# Altium schematic sheet LED fix910 RD 2000278 (4F00223A_7P00493A)_2.SchDoc
size 599 x 241 mm
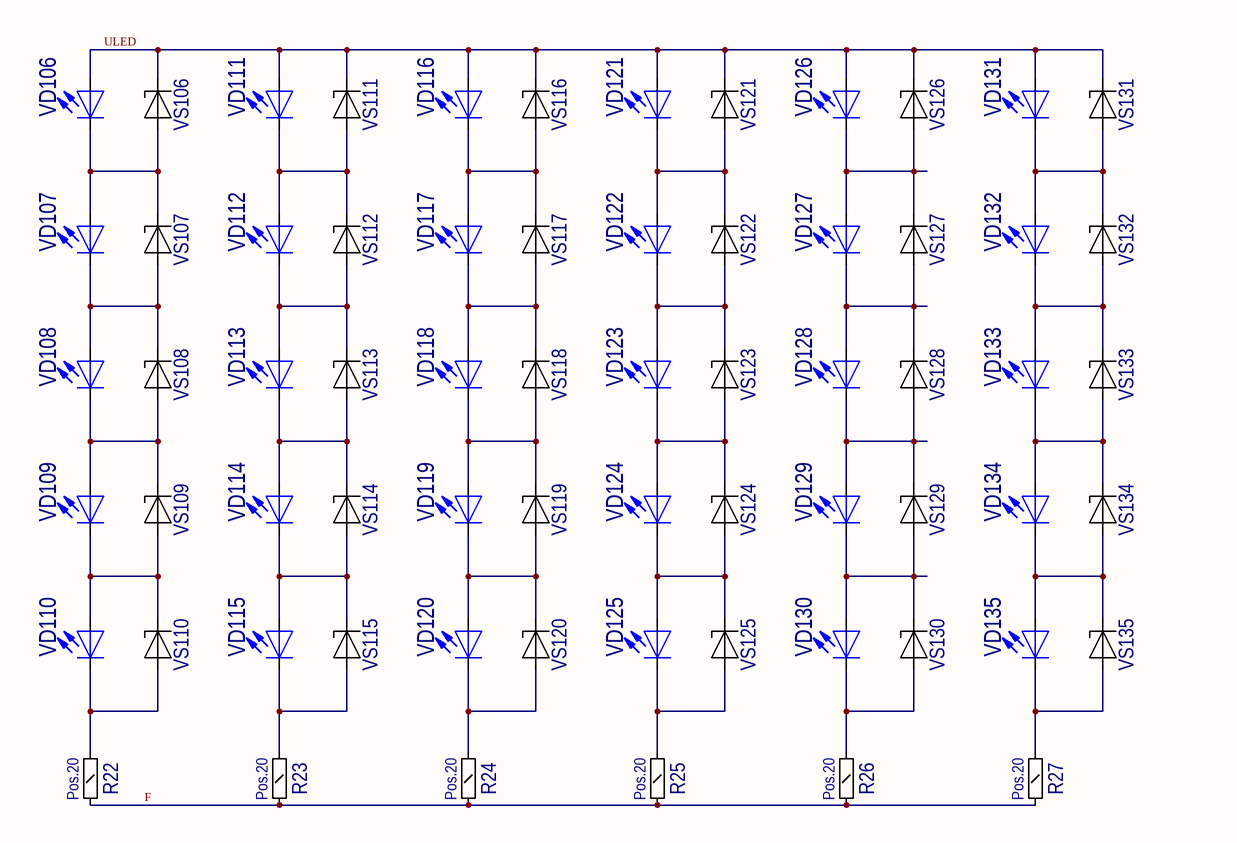
[diagram p0: LED fix910 RD 2000278 (4F00223A_7P00493A)_2.SchDoc, left]
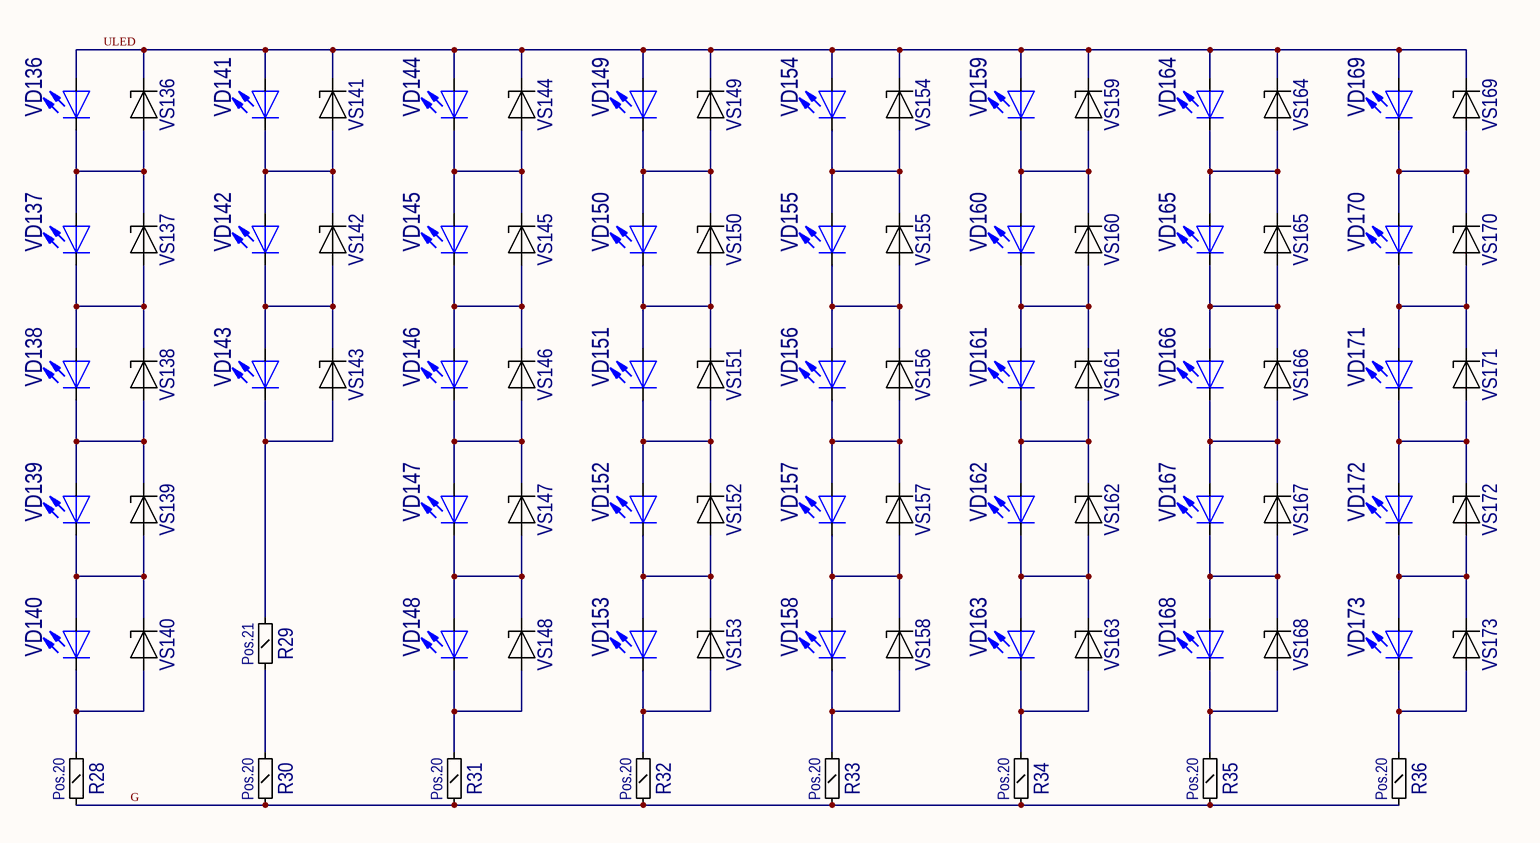
[diagram p1: LED fix910 RD 2000278 (4F00223A_7P00493A)_2.SchDoc, right]

## Parts
R22  value Pos.20  [RC1206S]  (hidden comment: R1206S)
R23  value Pos.20  [RC1206S]  (hidden comment: R1206S)
R24  value Pos.20  [RC1206S]  (hidden comment: R1206S)
R25  value Pos.20  [RC1206S]  (hidden comment: R1206S)
R26  value Pos.20  [RC1206S]  (hidden comment: R1206S)
R27  value Pos.20  [RC1206S]  (hidden comment: R1206S)
R28  value Pos.20  [RC1206S]  (hidden comment: R1206S)
R29  value Pos.21  [RC1206S]  (hidden comment: R1206S)
R30  value Pos.20  [RC1206S]  (hidden comment: R1206S)
R31  value Pos.20  [RC1206S]  (hidden comment: R1206S)
R32  value Pos.20  [RC1206S]  (hidden comment: R1206S)
R33  value Pos.20  [RC1206S]  (hidden comment: R1206S)
R34  value Pos.20  [RC1206S]  (hidden comment: R1206S)
R35  value Pos.20  [RC1206S]  (hidden comment: R1206S)
R36  value Pos.20  [RC1206S]  (hidden comment: R1206S)
VD106  LED, LS E65F-BBDA-1-Z, Red, OSRAM Opto Semiconductors Inc.  [E65F]  (value not drawn)
VD107  LED, LS E65F-BBDA-1-Z, Red, OSRAM Opto Semiconductors Inc.  [E65F]  (value not drawn)
VD108  LED, LS E65F-BBDA-1-Z, Red, OSRAM Opto Semiconductors Inc.  [E65F]  (value not drawn)
VD109  LED, LS E65F-BBDA-1-Z, Red, OSRAM Opto Semiconductors Inc.  [E65F]  (value not drawn)
VD110  LED, LS E65F-BBDA-1-Z, Red, OSRAM Opto Semiconductors Inc.  [E65F]  (value not drawn)
VD111  LED, LS E65F-BBDA-1-Z, Red, OSRAM Opto Semiconductors Inc.  [E65F]  (value not drawn)
VD112  LED, LS E65F-BBDA-1-Z, Red, OSRAM Opto Semiconductors Inc.  [E65F]  (value not drawn)
VD113  LED, LS E65F-BBDA-1-Z, Red, OSRAM Opto Semiconductors Inc.  [E65F]  (value not drawn)
VD114  LED, LS E65F-BBDA-1-Z, Red, OSRAM Opto Semiconductors Inc.  [E65F]  (value not drawn)
VD115  LED, LS E65F-BBDA-1-Z, Red, OSRAM Opto Semiconductors Inc.  [E65F]  (value not drawn)
VD116  LED, LS E65F-BBDA-1-Z, Red, OSRAM Opto Semiconductors Inc.  [E65F]  (value not drawn)
VD117  LED, LS E65F-BBDA-1-Z, Red, OSRAM Opto Semiconductors Inc.  [E65F]  (value not drawn)
VD118  LED, LS E65F-BBDA-1-Z, Red, OSRAM Opto Semiconductors Inc.  [E65F]  (value not drawn)
VD119  LED, LS E65F-BBDA-1-Z, Red, OSRAM Opto Semiconductors Inc.  [E65F]  (value not drawn)
VD120  LED, LS E65F-BBDA-1-Z, Red, OSRAM Opto Semiconductors Inc.  [E65F]  (value not drawn)
VD121  LED, LS E65F-BBDA-1-Z, Red, OSRAM Opto Semiconductors Inc.  [E65F]  (value not drawn)
VD122  LED, LS E65F-BBDA-1-Z, Red, OSRAM Opto Semiconductors Inc.  [E65F]  (value not drawn)
VD123  LED, LS E65F-BBDA-1-Z, Red, OSRAM Opto Semiconductors Inc.  [E65F]  (value not drawn)
VD124  LED, LS E65F-BBDA-1-Z, Red, OSRAM Opto Semiconductors Inc.  [E65F]  (value not drawn)
VD125  LED, LS E65F-BBDA-1-Z, Red, OSRAM Opto Semiconductors Inc.  [E65F]  (value not drawn)
VD126  LED, LS E65F-BBDA-1-Z, Red, OSRAM Opto Semiconductors Inc.  [E65F]  (value not drawn)
VD127  LED, LS E65F-BBDA-1-Z, Red, OSRAM Opto Semiconductors Inc.  [E65F]  (value not drawn)
VD128  LED, LS E65F-BBDA-1-Z, Red, OSRAM Opto Semiconductors Inc.  [E65F]  (value not drawn)
VD129  LED, LS E65F-BBDA-1-Z, Red, OSRAM Opto Semiconductors Inc.  [E65F]  (value not drawn)
VD130  LED, LS E65F-BBDA-1-Z, Red, OSRAM Opto Semiconductors Inc.  [E65F]  (value not drawn)
VD131  LED, LS E65F-BBDA-1-Z, Red, OSRAM Opto Semiconductors Inc.  [E65F]  (value not drawn)
VD132  LED, LS E65F-BBDA-1-Z, Red, OSRAM Opto Semiconductors Inc.  [E65F]  (value not drawn)
VD133  LED, LS E65F-BBDA-1-Z, Red, OSRAM Opto Semiconductors Inc.  [E65F]  (value not drawn)
VD134  LED, LS E65F-BBDA-1-Z, Red, OSRAM Opto Semiconductors Inc.  [E65F]  (value not drawn)
VD135  LED, LS E65F-BBDA-1-Z, Red, OSRAM Opto Semiconductors Inc.  [E65F]  (value not drawn)
VD136  LED, LS E65F-BBDA-1-Z, Red, OSRAM Opto Semiconductors Inc.  [E65F]  (value not drawn)
VD137  LED, LS E65F-BBDA-1-Z, Red, OSRAM Opto Semiconductors Inc.  [E65F]  (value not drawn)
VD138  LED, LS E65F-BBDA-1-Z, Red, OSRAM Opto Semiconductors Inc.  [E65F]  (value not drawn)
VD139  LED, LS E65F-BBDA-1-Z, Red, OSRAM Opto Semiconductors Inc.  [E65F]  (value not drawn)
VD140  LED, LS E65F-BBDA-1-Z, Red, OSRAM Opto Semiconductors Inc.  [E65F]  (value not drawn)
VD141  LED, LS E65F-BBDA-1-Z, Red, OSRAM Opto Semiconductors Inc.  [E65F]  (value not drawn)
VD142  LED, LS E65F-BBDA-1-Z, Red, OSRAM Opto Semiconductors Inc.  [E65F]  (value not drawn)
VD143  LED, LS E65F-BBDA-1-Z, Red, OSRAM Opto Semiconductors Inc.  [E65F]  (value not drawn)
VD144  LED, LS E65F-BBDA-1-Z, Red, OSRAM Opto Semiconductors Inc.  [E65F]  (value not drawn)
VD145  LED, LS E65F-BBDA-1-Z, Red, OSRAM Opto Semiconductors Inc.  [E65F]  (value not drawn)
VD146  LED, LS E65F-BBDA-1-Z, Red, OSRAM Opto Semiconductors Inc.  [E65F]  (value not drawn)
VD147  LED, LS E65F-BBDA-1-Z, Red, OSRAM Opto Semiconductors Inc.  [E65F]  (value not drawn)
VD148  LED, LS E65F-BBDA-1-Z, Red, OSRAM Opto Semiconductors Inc.  [E65F]  (value not drawn)
VD149  LED, LS E65F-BBDA-1-Z, Red, OSRAM Opto Semiconductors Inc.  [E65F]  (value not drawn)
VD150  LED, LS E65F-BBDA-1-Z, Red, OSRAM Opto Semiconductors Inc.  [E65F]  (value not drawn)
VD151  LED, LS E65F-BBDA-1-Z, Red, OSRAM Opto Semiconductors Inc.  [E65F]  (value not drawn)
VD152  LED, LS E65F-BBDA-1-Z, Red, OSRAM Opto Semiconductors Inc.  [E65F]  (value not drawn)
VD153  LED, LS E65F-BBDA-1-Z, Red, OSRAM Opto Semiconductors Inc.  [E65F]  (value not drawn)
VD154  LED, LS E65F-BBDA-1-Z, Red, OSRAM Opto Semiconductors Inc.  [E65F]  (value not drawn)
VD155  LED, LS E65F-BBDA-1-Z, Red, OSRAM Opto Semiconductors Inc.  [E65F]  (value not drawn)
VD156  LED, LS E65F-BBDA-1-Z, Red, OSRAM Opto Semiconductors Inc.  [E65F]  (value not drawn)
VD157  LED, LS E65F-BBDA-1-Z, Red, OSRAM Opto Semiconductors Inc.  [E65F]  (value not drawn)
VD158  LED, LS E65F-BBDA-1-Z, Red, OSRAM Opto Semiconductors Inc.  [E65F]  (value not drawn)
VD159  LED, LS E65F-BBDA-1-Z, Red, OSRAM Opto Semiconductors Inc.  [E65F]  (value not drawn)
VD160  LED, LS E65F-BBDA-1-Z, Red, OSRAM Opto Semiconductors Inc.  [E65F]  (value not drawn)
VD161  LED, LS E65F-BBDA-1-Z, Red, OSRAM Opto Semiconductors Inc.  [E65F]  (value not drawn)
VD162  LED, LS E65F-BBDA-1-Z, Red, OSRAM Opto Semiconductors Inc.  [E65F]  (value not drawn)
VD163  LED, LS E65F-BBDA-1-Z, Red, OSRAM Opto Semiconductors Inc.  [E65F]  (value not drawn)
VD164  LED, LS E65F-BBDA-1-Z, Red, OSRAM Opto Semiconductors Inc.  [E65F]  (value not drawn)
VD165  LED, LS E65F-BBDA-1-Z, Red, OSRAM Opto Semiconductors Inc.  [E65F]  (value not drawn)
VD166  LED, LS E65F-BBDA-1-Z, Red, OSRAM Opto Semiconductors Inc.  [E65F]  (value not drawn)
VD167  LED, LS E65F-BBDA-1-Z, Red, OSRAM Opto Semiconductors Inc.  [E65F]  (value not drawn)
VD168  LED, LS E65F-BBDA-1-Z, Red, OSRAM Opto Semiconductors Inc.  [E65F]  (value not drawn)
VD169  LED, LS E65F-BBDA-1-Z, Red, OSRAM Opto Semiconductors Inc.  [E65F]  (value not drawn)
VD170  LED, LS E65F-BBDA-1-Z, Red, OSRAM Opto Semiconductors Inc.  [E65F]  (value not drawn)
VD171  LED, LS E65F-BBDA-1-Z, Red, OSRAM Opto Semiconductors Inc.  [E65F]  (value not drawn)
VD172  LED, LS E65F-BBDA-1-Z, Red, OSRAM Opto Semiconductors Inc.  [E65F]  (value not drawn)
VD173  LED, LS E65F-BBDA-1-Z, Red, OSRAM Opto Semiconductors Inc.  [E65F]  (value not drawn)
VS106  BZX84  [SOT23]  (value not drawn)
VS107  BZX84  [SOT23]  (value not drawn)
VS108  BZX84  [SOT23]  (value not drawn)
VS109  BZX84  [SOT23]  (value not drawn)
VS110  BZX84  [SOT23]  (value not drawn)
VS111  BZX84  [SOT23]  (value not drawn)
VS112  BZX84  [SOT23]  (value not drawn)
VS113  BZX84  [SOT23]  (value not drawn)
VS114  BZX84  [SOT23]  (value not drawn)
VS115  BZX84  [SOT23]  (value not drawn)
VS116  BZX84  [SOT23]  (value not drawn)
VS117  BZX84  [SOT23]  (value not drawn)
VS118  BZX84  [SOT23]  (value not drawn)
VS119  BZX84  [SOT23]  (value not drawn)
VS120  BZX84  [SOT23]  (value not drawn)
VS121  BZX84  [SOT23]  (value not drawn)
VS122  BZX84  [SOT23]  (value not drawn)
VS123  BZX84  [SOT23]  (value not drawn)
VS124  BZX84  [SOT23]  (value not drawn)
VS125  BZX84  [SOT23]  (value not drawn)
VS126  BZX84  [SOT23]  (value not drawn)
VS127  BZX84  [SOT23]  (value not drawn)
VS128  BZX84  [SOT23]  (value not drawn)
VS129  BZX84  [SOT23]  (value not drawn)
VS130  BZX84  [SOT23]  (value not drawn)
VS131  BZX84  [SOT23]  (value not drawn)
VS132  BZX84  [SOT23]  (value not drawn)
VS133  BZX84  [SOT23]  (value not drawn)
VS134  BZX84  [SOT23]  (value not drawn)
VS135  BZX84  [SOT23]  (value not drawn)
VS136  BZX84  [SOT23]  (value not drawn)
VS137  BZX84  [SOT23]  (value not drawn)
VS138  BZX84  [SOT23]  (value not drawn)
VS139  BZX84  [SOT23]  (value not drawn)
VS140  BZX84  [SOT23]  (value not drawn)
VS141  BZX84  [SOT23]  (value not drawn)
VS142  BZX84  [SOT23]  (value not drawn)
VS143  BZX84  [SOT23]  (value not drawn)
VS144  BZX84  [SOT23]  (value not drawn)
VS145  BZX84  [SOT23]  (value not drawn)
VS146  BZX84  [SOT23]  (value not drawn)
VS147  BZX84  [SOT23]  (value not drawn)
VS148  BZX84  [SOT23]  (value not drawn)
VS149  BZX84  [SOT23]  (value not drawn)
VS150  BZX84  [SOT23]  (value not drawn)
VS151  BZX84  [SOT23]  (value not drawn)
VS152  BZX84  [SOT23]  (value not drawn)
VS153  BZX84  [SOT23]  (value not drawn)
VS154  BZX84  [SOT23]  (value not drawn)
VS155  BZX84  [SOT23]  (value not drawn)
VS156  BZX84  [SOT23]  (value not drawn)
VS157  BZX84  [SOT23]  (value not drawn)
VS158  BZX84  [SOT23]  (value not drawn)
VS159  BZX84  [SOT23]  (value not drawn)
VS160  BZX84  [SOT23]  (value not drawn)
VS161  BZX84  [SOT23]  (value not drawn)
VS162  BZX84  [SOT23]  (value not drawn)
VS163  BZX84  [SOT23]  (value not drawn)
VS164  BZX84  [SOT23]  (value not drawn)
VS165  BZX84  [SOT23]  (value not drawn)
VS166  BZX84  [SOT23]  (value not drawn)
VS167  BZX84  [SOT23]  (value not drawn)
VS168  BZX84  [SOT23]  (value not drawn)
VS169  BZX84  [SOT23]  (value not drawn)
VS170  BZX84  [SOT23]  (value not drawn)
VS171  BZX84  [SOT23]  (value not drawn)
VS172  BZX84  [SOT23]  (value not drawn)
VS173  BZX84  [SOT23]  (value not drawn)

## Nets
F: R22.2 R23.2 R24.2 R25.2 R26.2 R27.2
G: R28.2 R30.2 R31.2 R32.2 R33.2 R34.2 R35.2 R36.2
ULED: VD106.2(A) VD111.2(A) VD116.2(A) VD121.2(A) VD126.2(A) VD131.2(A) VD136.2(A) VD141.2(A) VD144.2(A) VD149.2(A) VD154.2(A) VD159.2(A) VD164.2(A) VD169.2(A) VS106.3 VS111.3 VS116.3 VS121.3 VS126.3 VS131.3 VS136.3 VS141.3 VS144.3 VS149.3 VS154.3 VS159.3 VS164.3 VS169.3
NetR22_1: R22.1 VD110.1(K) VS110.1
NetR23_1: R23.1 VD115.1(K) VS115.1
NetR24_1: R24.1 VD120.1(K) VS120.1
NetR25_1: R25.1 VD125.1(K) VS125.1
NetR26_1: R26.1 VD130.1(K) VS130.1
NetR27_1: R27.1 VD135.1(K) VS135.1
NetR28_1: R28.1 VD140.1(K) VS140.1
NetR29_1: R29.1 VD143.1(K) VS143.1
NetR29_2: R29.2 R30.1
NetR31_1: R31.1 VD148.1(K) VS148.1
NetR32_1: R32.1 VD153.1(K) VS153.1
NetR33_1: R33.1 VD158.1(K) VS158.1
NetR34_1: R34.1 VD163.1(K) VS163.1
NetR35_1: R35.1 VD168.1(K) VS168.1
NetR36_1: R36.1 VD173.1(K) VS173.1
NetVD106_1: VD106.1(K) VD107.2(A) VS106.1 VS107.3
NetVD107_1: VD107.1(K) VD108.2(A) VS107.1 VS108.3
NetVD108_1: VD108.1(K) VD109.2(A) VS108.1 VS109.3
NetVD109_1: VD109.1(K) VD110.2(A) VS109.1 VS110.3
NetVD111_1: VD111.1(K) VD112.2(A) VS111.1 VS112.3
NetVD112_1: VD112.1(K) VD113.2(A) VS112.1 VS113.3
NetVD113_1: VD113.1(K) VD114.2(A) VS113.1 VS114.3
NetVD114_1: VD114.1(K) VD115.2(A) VS114.1 VS115.3
NetVD116_1: VD116.1(K) VD117.2(A) VS116.1 VS117.3
NetVD117_1: VD117.1(K) VD118.2(A) VS117.1 VS118.3
NetVD118_1: VD118.1(K) VD119.2(A) VS118.1 VS119.3
NetVD119_1: VD119.1(K) VD120.2(A) VS119.1 VS120.3
NetVD121_1: VD121.1(K) VD122.2(A) VS121.1 VS122.3
NetVD122_1: VD122.1(K) VD123.2(A) VS122.1 VS123.3
NetVD123_1: VD123.1(K) VD124.2(A) VS123.1 VS124.3
NetVD124_1: VD124.1(K) VD125.2(A) VS124.1 VS125.3
NetVD126_1: VD126.1(K) VD127.2(A) VS126.1 VS127.3
NetVD127_1: VD127.1(K) VD128.2(A) VS127.1 VS128.3
NetVD128_1: VD128.1(K) VD129.2(A) VS128.1 VS129.3
NetVD129_1: VD129.1(K) VD130.2(A) VS129.1 VS130.3
NetVD131_1: VD131.1(K) VD132.2(A) VS131.1 VS132.3
NetVD132_1: VD132.1(K) VD133.2(A) VS132.1 VS133.3
NetVD133_1: VD133.1(K) VD134.2(A) VS133.1 VS134.3
NetVD134_1: VD134.1(K) VD135.2(A) VS134.1 VS135.3
NetVD136_1: VD136.1(K) VD137.2(A) VS136.1 VS137.3
NetVD137_1: VD137.1(K) VD138.2(A) VS137.1 VS138.3
NetVD138_1: VD138.1(K) VD139.2(A) VS138.1 VS139.3
NetVD139_1: VD139.1(K) VD140.2(A) VS139.1 VS140.3
NetVD141_1: VD141.1(K) VD142.2(A) VS141.1 VS142.3
NetVD142_1: VD142.1(K) VD143.2(A) VS142.1 VS143.3
NetVD144_1: VD144.1(K) VD145.2(A) VS144.1 VS145.3
NetVD145_1: VD145.1(K) VD146.2(A) VS145.1 VS146.3
NetVD146_1: VD146.1(K) VD147.2(A) VS146.1 VS147.3
NetVD147_1: VD147.1(K) VD148.2(A) VS147.1 VS148.3
NetVD149_1: VD149.1(K) VD150.2(A) VS149.1 VS150.3
NetVD150_1: VD150.1(K) VD151.2(A) VS150.1 VS151.3
NetVD151_1: VD151.1(K) VD152.2(A) VS151.1 VS152.3
NetVD152_1: VD152.1(K) VD153.2(A) VS152.1 VS153.3
NetVD154_1: VD154.1(K) VD155.2(A) VS154.1 VS155.3
NetVD155_1: VD155.1(K) VD156.2(A) VS155.1 VS156.3
NetVD156_1: VD156.1(K) VD157.2(A) VS156.1 VS157.3
NetVD157_1: VD157.1(K) VD158.2(A) VS157.1 VS158.3
NetVD159_1: VD159.1(K) VD160.2(A) VS159.1 VS160.3
NetVD160_1: VD160.1(K) VD161.2(A) VS160.1 VS161.3
NetVD161_1: VD161.1(K) VD162.2(A) VS161.1 VS162.3
NetVD162_1: VD162.1(K) VD163.2(A) VS162.1 VS163.3
NetVD164_1: VD164.1(K) VD165.2(A) VS164.1 VS165.3
NetVD165_1: VD165.1(K) VD166.2(A) VS165.1 VS166.3
NetVD166_1: VD166.1(K) VD167.2(A) VS166.1 VS167.3
NetVD167_1: VD167.1(K) VD168.2(A) VS167.1 VS168.3
NetVD169_1: VD169.1(K) VD170.2(A) VS169.1 VS170.3
NetVD170_1: VD170.1(K) VD171.2(A) VS170.1 VS171.3
NetVD171_1: VD171.1(K) VD172.2(A) VS171.1 VS172.3
NetVD172_1: VD172.1(K) VD173.2(A) VS172.1 VS173.3

Not connected (* = marked no-connect by the designer): VS106 2; VS107 2; VS108 2; VS109 2; VS110 2; VS111 2; VS112 2; VS113 2; VS114 2; VS115 2; VS116 2; VS117 2; VS118 2; VS119 2; VS120 2; VS121 2; VS122 2; VS123 2; VS124 2; VS125 2; VS126 2; VS127 2; VS128 2; VS129 2; VS130 2; VS131 2; VS132 2; VS133 2; VS134 2; VS135 2; VS136 2; VS137 2; VS138 2; VS139 2; VS140 2; VS141 2; VS142 2; VS143 2; VS144 2; VS145 2; VS146 2; VS147 2; VS148 2; VS149 2; VS150 2; VS151 2; VS152 2; VS153 2; VS154 2; VS155 2; VS156 2; VS157 2; VS158 2; VS159 2; VS160 2; VS161 2; VS162 2; VS163 2; VS164 2; VS165 2; VS166 2; VS167 2; VS168 2; VS169 2; VS170 2; VS171 2; VS172 2; VS173 2

## Library data of the parts
VD106-VD173 = 4176: idComponent: 4176; Jofre_PN: HL1032; Component_Group: Diodes; Tech_Specification: LED Chip, LS E65F-BBDA-1-Z, Red, 633nm, 3920mcd, 60 deg, 2,15V, 50 mA, -40°C...+85°C, PLCC-4, OSRAM Opto Semiconductors Inc.; Mounting_Type: SMD; Operating_Temperature: -40°C...+85°C; Notes: price Digi-Key @2.000; User: ke-sta@kd-sta; Value: LS E65F-BBDA-1-Z; Component_Type: LED; Package: PLCC-4; Marking_Code: -; Manufacturer: OSRAM Opto Semiconductors Inc.; Manufacturer_PN: LS E65F-BBDA-1-Z; ComponentLink1Description: Datasheet; ComponentLink1URL: https://media.digikey.com/pdf/Data%20Sheets/Osram%20PDFs/LS_E65F_Rev1.2.pdf; Price_EUR: 0,15835; Status: Unchecked; Date_of_Update: 12.11.2018 13:55:11; Date_of_Creation: 30.10.2018 19:15:38
VS106-VS173 = BZX84: OriginalName: DIODE; Value: *